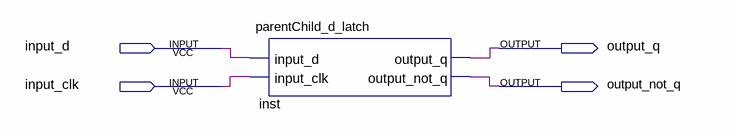
[diagram p0: schematic sheet]
// Quartus schematic parentChildLatch.bdf as structural Verilog: 1 symbols, 4 pins
module parentChildLatch (
  input  input_d,
  input  input_clk,
  output output_q,
  output output_not_q
);

  parentChild_d_latch inst (.input_d(input_d), .input_clk(input_clk), .output_q(output_q), .output_not_q(output_not_q));
endmodule
